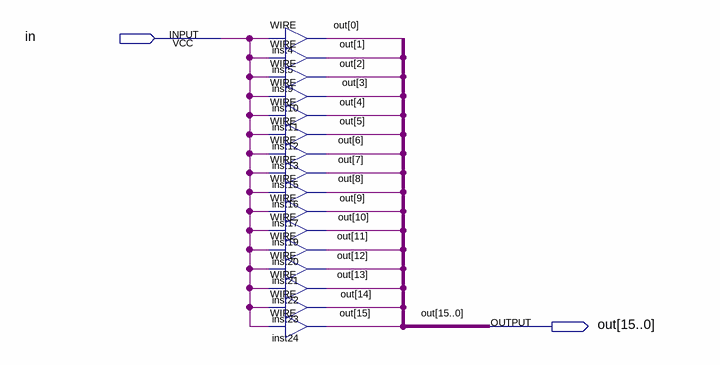
[diagram p0: schematic sheet]
// Quartus schematic extend1to16.bdf as structural Verilog: 16 symbols, 2 pins
module extend1to16 (
  input  in,
  output [15:0] out
);

  assign out[0] = in;  // WIRE inst4
  assign out[1] = in;  // WIRE inst5
  assign out[2] = in;  // WIRE inst9
  assign out[3] = in;  // WIRE inst10
  assign out[4] = in;  // WIRE inst11
  assign out[5] = in;  // WIRE inst12
  assign out[6] = in;  // WIRE inst13
  assign out[7] = in;  // WIRE inst15
  assign out[8] = in;  // WIRE inst16
  assign out[9] = in;  // WIRE inst17
  assign out[10] = in;  // WIRE inst19
  assign out[11] = in;  // WIRE inst20
  assign out[12] = in;  // WIRE inst21
  assign out[13] = in;  // WIRE inst22
  assign out[14] = in;  // WIRE inst23
  assign out[15] = in;  // WIRE inst24
endmodule
